# Altium schematic sheet 01_Power.SchDoc: Power
size A4; SheetNumber: 1; SheetTotal: 3; PageSetup: Record=PageOptions|CenterHorizontal=True|CenterVertical=True|PrintScale=1.09|XCorrection=1.00|YCorrection=1.00|PrintKind=0|BorderSize=5000000|LeftOffset=0|BottomOffset=0|Orientation=2|PaperLength=1000|PaperWidth=1000|Scale=100|PaperSource=7|PrintQuality=-3|MediaType=1|DitherType=10|PrintScaleMode=1|PaperKind=A4|PaperIndex=9; SK_ProjectName: Analog Resource Monitor; Version: R01
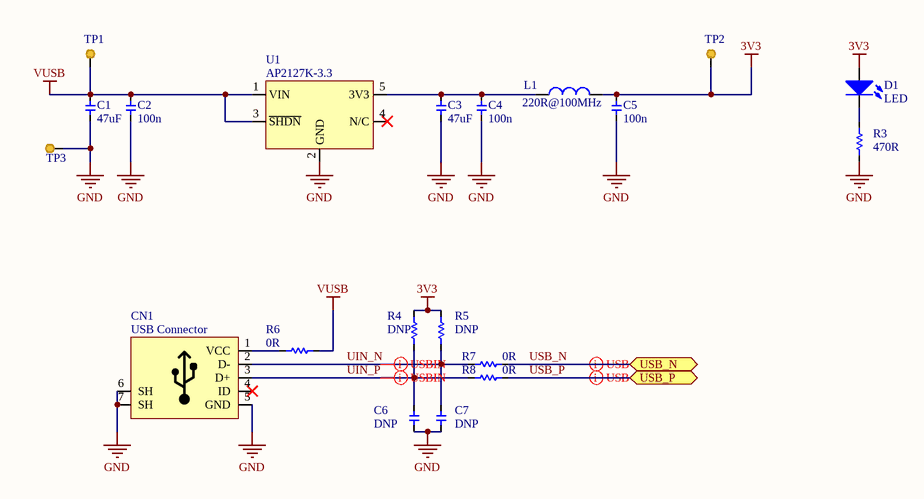
[diagram p0: 01_Power.SchDoc]

## Parts
C1  value 47uF  [0805]  (hidden comment: Cap)
C2  value 100n  [0603 - CAP]  (hidden comment: Cap)
C3  value 47uF  [0805]  (hidden comment: Cap)
C4  value 100n  [0603 - CAP]  (hidden comment: Cap)
C5  value 100n  [0603 - CAP]  (hidden comment: Cap)
C6  value DNP  [0603 - CAP]  (hidden comment: Cap)  (no BOM)
C7  value DNP  [0603 - CAP]  (hidden comment: Cap)  (no BOM)
CN1  USB Connector  [Amphenol FCI 10118192-0001LF]
D1  LED  [0603 Diode]
L1  value 220R@100MHz  [0603]  (hidden comment: Inductor)
R3  value 470R  [0603]  (hidden comment: Res)
R4  value DNP  [0603]  (hidden comment: Res)
R5  value DNP  [0603]  (hidden comment: Res)  (no BOM)
R6  value 0R  [0603]  (hidden comment: Res)
R7  value 0R  [0603]  (hidden comment: Res)
R8  value 0R  [0603]  (hidden comment: Res)
TP1  Test Point 0.6mm  [TP_SMD_1mm]  (value not drawn)  (no BOM)
TP2  Test Point 0.6mm  [TP_SMD_1mm]  (value not drawn)  (no BOM)
TP3  Test Point 0.6mm  [TP_SMD_1mm]  (value not drawn)  (no BOM)
U1  AP2127K-3.3  [SOT-23-5]

## Ports
USB_N (bidir), USB_P (bidir)

## Nets
3V3: C5.2 D1.A L1.2 R4.1 R5.1 TP2.1
GND: C1.1 C2.1 C3.1 C4.1 C5.1 C6.1 C7.1 CN1.5(GND) CN1.6(SH) CN1.7(SH) R3.2 TP3.1 U1.2(GND)
VUSB: C1.2 C2.2 R6.1 TP1.1 U1.1(VIN) U1.3(~{SHDN})
UIN_N: C7.2 CN1.2(D-) R5.2 R7.2
UIN_P: C6.2 CN1.3(D+) R4.2 R8.2
USB_N: R7.1 ; port USB_N
USB_P: R8.1 ; port USB_P
NetC3_2: C3.2 C4.2 L1.1 U1.5(3V3)
NetCN1_1: CN1.1(VCC) R6.2
NetD1_K: D1.K R3.1

Not connected (* = marked no-connect by the designer): CN1 4(ID)*; U1 4(N/C)*

## Layout directives
differential pair: UIN_N, UIN_P, USB_N, USB_P

## Notes on the sheet
- Title:
- Project:
- Version:
- sasakaranovic.com
- Sasa Karanovic
- Project available at
- Date:
- Time:
- Sheet
- of

## Library data of the parts
C1 C3 = Cap: CAP TANT POLY47UF 20% 16V 1210; Manufacturer: AVX Corporation; Manufacturer Part Number: TCNT476M016R0200A; Distributor Part Number: 478-9595-1-ND; Distributor: DigiKey
C2 C4-C7 = Cap: Capacitor; Manufacturer: AVX Corporation; Manufacturer Part Number: 06035C104KAT2A; Distributor Part Number: 478-5052-1-ND; Distributor: DigiKey
CN1 = Amphenol FCI 10118192-0001LF: CONN USB MICRO B RECPT SMT R/A; Distributor: DigiKey; Manufacturer: Amphenol FCI; Distributor Part Number: 609-4613-1-ND; Manufacturer Part Number: 10118192-0001LF
D1 = LED: Typical RED GaAs LED; Distributor: DigiKey
L1 = Inductor: FERRITE BEAD 220 OHM 0603 1LN; Manufacturer: Murata Electronics North America; Manufacturer Part Number: BLM18KG221SN1D; Distributor: DigiKey; Distributor Part Number: 490-5255-1-ND
R3 = Res: Resistor; Manufacturer: Yageo; Manufacturer Part Number: RC0603FR-07470RL; Distributor: DigiKey; Distributor Part Number: 311-470HRCT-ND
R4-R8 = Res: Resistor; Manufacturer: Yageo; Manufacturer Part Number: RC0603JR-070RL; Distributor: DigiKey; Distributor Part Number: 311-0.0GRCT-ND
TP1-TP3 = TP
U1 = AP2127K-3.3TRG1: IC REG LINEAR 3.3V 300MA SOT23-5; Manufacturer: Diodes Incorporated; Distributor: DigiKey; Distributor Part Number: AP2127K-3.3TRG1DICT-ND; Manufacturer Part Number: AP2127K-3.3TRG1